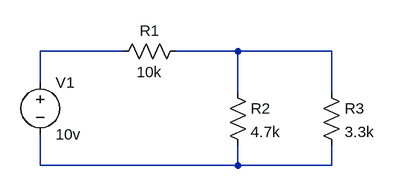
[diagram p0: schematic simulacion.asc]
simulacion.asc, the LTspice schematic file:
Version 4.1
SHEET 1 880 680
WIRE 96 80 -32 80
WIRE 272 80 176 80
WIRE 416 80 272 80
WIRE -32 128 -32 80
WIRE 272 144 272 80
WIRE 416 144 416 80
WIRE -32 256 -32 208
WIRE 272 256 272 224
WIRE 272 256 -32 256
WIRE 416 256 416 224
WIRE 416 256 272 256
SYMBOL res 192 64 R90
WINDOW 0 0 56 VBottom 2
WINDOW 3 32 56 VTop 2
SYMATTR InstName R1
SYMATTR Value 10k
SYMBOL res 256 128 R0
SYMATTR InstName R2
SYMATTR Value 4.7k
SYMBOL res 400 128 R0
SYMATTR InstName R3
SYMATTR Value 3.3k
SYMBOL voltage -32 112 R0
WINDOW 123 0 0 Left 0
WINDOW 39 0 0 Left 0
SYMATTR InstName V1
SYMATTR Value 10v

The netlist it stands for:
* simulacion.asc
R1 N002 N001 10k
R2 N002 N003 4.7k
R3 N002 N003 3.3k
V1 N001 N003 10v
.backanno
.end